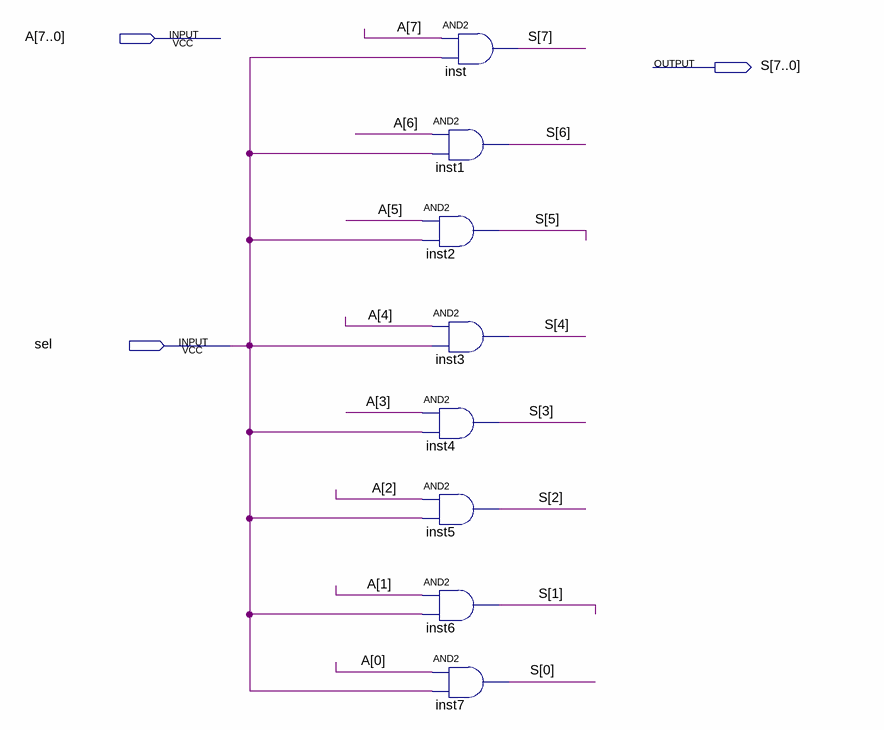
[diagram p0: schematic sheet]
// Quartus schematic and_sel_8bits.bdf as structural Verilog: 8 symbols, 3 pins
module and_sel_8bits (
  input  [7:0] A,
  input  sel,
  output [7:0] S
);

  and inst (S[7], A[7], sel);
  and inst1 (S[6], A[6], sel);
  and inst2 (S[5], A[5], sel);
  and inst3 (S[4], A[4], sel);
  and inst4 (S[3], A[3], sel);
  and inst5 (S[2], A[2], sel);
  and inst6 (S[1], A[1], sel);
  and inst7 (S[0], A[0], sel);
endmodule
